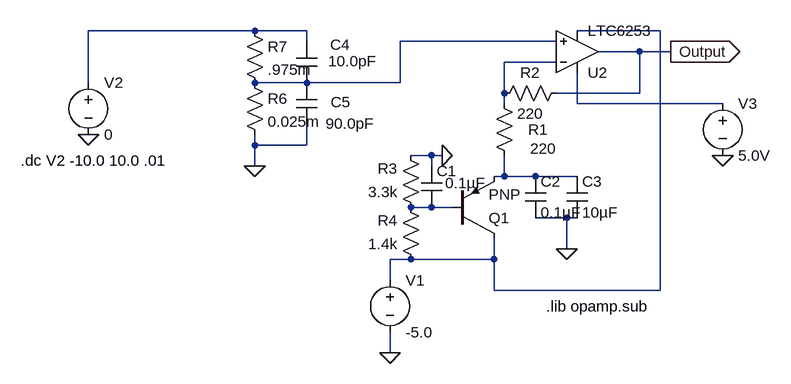
[diagram p0: schematic OPAMP-0.6Vp-p-bitscope.asc]
OPAMP-0.6Vp-p-bitscope.asc, the LTspice schematic file:
Version 4
SHEET 1 880 680
WIRE -336 -48 -592 -48
WIRE -256 -48 -336 -48
WIRE 288 -48 160 -48
WIRE -256 -32 -256 -48
WIRE 128 -32 -112 -32
WIRE 256 -16 192 -16
WIRE 304 -16 256 -16
WIRE 128 0 48 0
WIRE -592 32 -592 -48
WIRE -256 32 -336 32
WIRE -112 32 -112 -32
WIRE -112 32 -256 32
WIRE 48 48 48 0
WIRE 256 48 256 -16
WIRE 256 48 128 48
WIRE 48 64 48 48
WIRE 160 64 160 16
WIRE 384 64 160 64
WIRE -336 128 -336 112
WIRE -256 128 -256 96
WIRE -256 128 -336 128
WIRE -64 144 -96 144
WIRE -48 144 -64 144
WIRE -336 160 -336 128
WIRE -64 160 -64 144
WIRE 48 176 48 144
WIRE 48 176 32 176
WIRE 96 176 48 176
WIRE 160 176 96 176
WIRE -64 224 -96 224
WIRE -32 224 -64 224
WIRE 144 240 96 240
WIRE 160 240 144 240
WIRE 144 288 144 240
WIRE -96 304 -128 304
WIRE 32 304 32 272
WIRE 32 304 -96 304
WIRE -128 336 -128 304
WIRE 32 352 32 304
WIRE 288 352 288 -48
WIRE 288 352 32 352
WIRE -128 448 -128 416
FLAG -336 160 0
FLAG 304 -16 Output
IOPIN 304 -16 Out
FLAG -128 448 0
FLAG -48 144 0
FLAG 144 288 0
FLAG 384 144 0
FLAG -592 112 0
SYMBOL voltage -592 16 R0
WINDOW 123 0 0 Left 0
WINDOW 39 0 0 Left 0
SYMATTR InstName V2
SYMATTR Value 0
SYMBOL res 32 48 R0
WINDOW 0 53 56 Left 0
WINDOW 3 56 85 Left 0
SYMATTR InstName R1
SYMATTR Value 220
SYMBOL res -80 240 R180
WINDOW 0 36 76 Left 0
WINDOW 3 36 40 Left 0
SYMATTR InstName R3
SYMATTR Value 3.3k
SYMBOL res -80 320 R180
WINDOW 0 36 76 Left 0
WINDOW 3 36 40 Left 0
SYMATTR InstName R4
SYMATTR Value 1.4k
SYMBOL pnp -32 272 M180
SYMATTR InstName Q1
SYMBOL voltage -128 320 R0
WINDOW 123 0 0 Left 0
WINDOW 39 0 0 Left 0
SYMATTR InstName V1
SYMATTR Value -5.0
SYMBOL res 144 32 R90
WINDOW 0 0 56 VBottom 0
WINDOW 3 32 56 VTop 0
SYMATTR InstName R2
SYMATTR Value 220
SYMBOL cap -80 160 R0
WINDOW 3 37 26 Left 0
SYMATTR Value 0.1µF
SYMATTR InstName C1
SYMBOL cap 80 176 R0
SYMATTR InstName C2
SYMATTR Value 0.1µF
SYMBOL cap 144 176 R0
SYMATTR InstName C3
SYMATTR Value 10µF
SYMBOL Opamps\\LTC6253 160 -16 M180
SYMATTR InstName U2
SYMBOL voltage 384 48 R0
WINDOW 123 0 0 Left 0
WINDOW 39 0 0 Left 0
SYMATTR InstName V3
SYMATTR Value 5.0V
SYMBOL res -352 16 R0
SYMATTR InstName R6
SYMATTR Value 0.025m
SYMBOL res -352 -64 R0
SYMATTR InstName R7
SYMATTR Value .975m
SYMBOL cap -272 -32 R0
WINDOW 0 52 5 Left 0
WINDOW 3 49 31 Left 0
SYMATTR InstName C4
SYMATTR Value 10.0pF
SYMBOL cap -272 32 R0
WINDOW 0 53 30 Left 0
WINDOW 3 45 63 Left 0
SYMATTR InstName C5
SYMATTR Value 90.0pF
TEXT -696 152 Left 0 !.dc V2 -10.0 10.0 .01
TEXT 112 376 Left 0 !.lib opamp.sub

The netlist it stands for:
* OPAMP-0.6Vp-p-bitscope.asc
V2 N001 0 0
R1 N004 N006 220
R3 N007 0 3.3k
R4 N002 N007 1.4k
Q1 N002 N007 N006 0 PNP
V1 N002 0 -5.0
R2 Output N004 220
C1 0 N007 0.1µF
C2 N006 0 0.1µF
C3 N006 0 10µF
* U2: LTC6253 (symbol Opamps\LTC6253 not available, pins judged from their places): In+=N003 In-=N004 V+=N005 V-=N002 OUT=Output
V3 N005 0 5.0V
R6 N003 0 0.025m
R7 N001 N003 .975m
C4 N001 N003 10.0pF
C5 N003 0 90.0pF
.model NPN NPN
.model PNP PNP
.lib standard.bjt
.dc V2 -10.0 10.0 .01
.lib opamp.sub
.backanno
.end